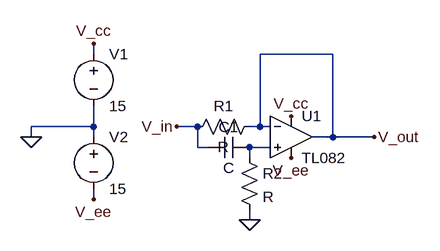
[diagram p0: schematic gyrateur.asc]
gyrateur.asc, the LTspice schematic file:
Version 4.1
SHEET 1 880 680
WIRE -112 32 -112 16
WIRE 256 32 144 32
WIRE -112 144 -112 112
WIRE -112 144 -208 144
WIRE 48 144 16 144
WIRE 144 144 144 32
WIRE 144 144 128 144
WIRE 160 144 144 144
WIRE -208 160 -208 144
WIRE -112 160 -112 144
WIRE 256 160 256 32
WIRE 256 160 224 160
WIRE 320 160 256 160
WIRE 48 176 48 144
WIRE 64 176 48 176
WIRE 160 176 128 176
WIRE 128 192 128 176
WIRE -112 256 -112 240
WIRE 128 288 128 272
FLAG -208 160 0
FLAG -112 256 V_ee
FLAG -112 16 V_cc
FLAG 192 128 V_cc
FLAG 192 192 V_ee
FLAG 16 144 V_in
FLAG 128 288 0
FLAG 320 160 V_out
SYMBOL OpAmps\\opamp2 192 96 R0
SYMATTR InstName U1
SYMATTR Value TL082
SYMBOL voltage -112 16 R0
WINDOW 123 0 0 Left 0
WINDOW 39 0 0 Left 0
SYMATTR InstName V1
SYMATTR Value 15
SYMBOL voltage -112 144 R0
WINDOW 123 0 0 Left 0
WINDOW 39 0 0 Left 0
SYMATTR InstName V2
SYMATTR Value 15
SYMBOL res 144 128 R90
WINDOW 0 0 56 VBottom 2
WINDOW 3 32 56 VTop 2
SYMATTR InstName R1
SYMBOL cap 128 160 R90
WINDOW 0 0 32 VBottom 2
WINDOW 3 32 32 VTop 2
SYMATTR InstName C1
SYMBOL res 112 176 R0
SYMATTR InstName R2

The netlist it stands for:
* gyrateur.asc
X§U1 N001 V_out V_cc V_ee V_out TL082  ; pins In+ In- V+ V- OUT
V1 V_cc 0 15
V2 0 V_ee 15
R1 V_out V_in R
C1 N001 V_in C
R2 N001 0 R
.backanno
.end